# Altium schematic sheet hv_psu_v100_FLYBACK.SchDoc
size A4; SheetNumber: 4; SheetTotal: 7
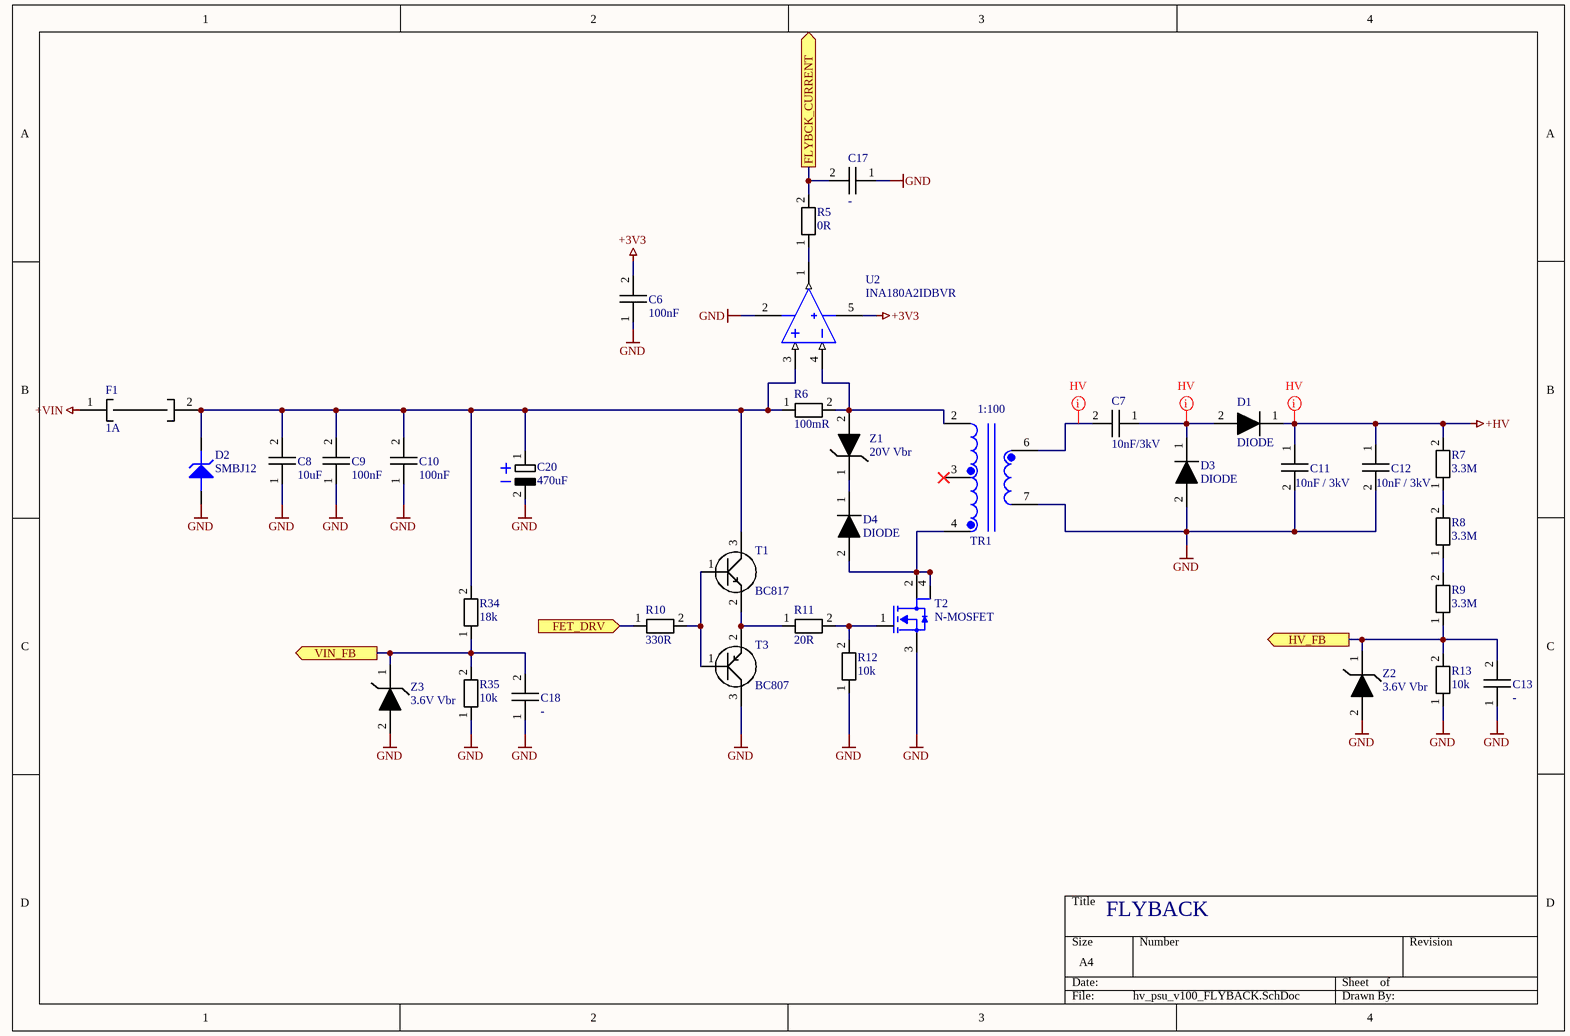
[diagram p0: hv_psu_v100_FLYBACK.SchDoc]

## Parts
C6  100nF  [1206_C]
C7  10nF/3kV  [2220_C]
C8  10uF  [1206_C]
C9  100nF  [1206_C]
C10  100nF  [1206_C]
C11  10nF / 3kV  [2220_C]
C12  10nF / 3kV  [2220_C]
C13  -  [1206_C]
C17  -  [1206_C]
C18  -  [1206_C]
C20  470uF  [CAPAE9383X110M]
D1  DIODE  [DIODE_400MIL]
D2  SMBJ12  [DO-214AA (SMB)]
D3  DIODE  [DIODE_400MIL]
D4  DIODE  [DIODE_400MIL]
F1  1A  [FUSE_1812L]
R5  0R  [1206]
R6  100mR  [1206]
R7  3.3M  [1206]
R8  3.3M  [1206]
R9  3.3M  [1206]
R10  330R  [1206]
R11  20R  [1206]
R12  10k  [1206]
R13  10k  [1206]
R34  18k  [1206]
R35  10k  [1206]
T1  BC817  [SOT23]
T2  N-MOSFET  [SOT233-1]
T3  BC807  [SOT23]
TR1  DARFON_CCFL_TRANSFORMER  [DARFON_CCFL_TRANSFORMER]  (value not drawn)
U2  INA180A2IDBVR  [SOT23-5]
Z1  20V Vbr  [SMD_DIODE_SOD80]
Z2  3.6V Vbr  [SMD_DIODE_SOD80]
Z3  3.6V Vbr  [SMD_DIODE_SOD80]

## Ports
FET_DRV (in), FLYBCK_CURRENT (out), HV_FB (out), VIN_FB (out)

## Nets
+3V3: C6.2 U2.5(V+)
+HV: C11.1 C12.1 D1.1 R7.2
+VIN: F1.1
GND: C6.1 C8.1 C9.1 C10.1 C11.2 C12.2 C13.1 C17.1 C18.1 C20.2 D2.A D3.2 R12.1 R13.1 R35.1 T2.3(S) T3.3 TR1.7 U2.2(V-) Z2.2 Z3.2
FET_DRV: R10.1 ; port FET_DRV
FLYBCK_CURRENT: C17.2 R5.2 ; port FLYBCK_CURRENT
HV_FB: C13.2 R9.1 R13.2 Z2.1 ; port HV_FB
VIN_FB: C18.2 R34.1 R35.2 Z3.1 ; port VIN_FB
NetC7_1: C7.1 D1.2 D3.1
NetC7_2: C7.2 TR1.6
NetC8_2: C8.2 C9.2 C10.2 C20.1 D2.K F1.2 R6.1 R34.2 T1.3 U2.3(IN+)
NetD4_1: D4.1 Z1.1
NetD4_2: D4.2 T2.2(D) T2.4(D) TR1.4
NetR5_1: R5.1 U2.1(OUT)
NetR6_2: R6.2 TR1.2 U2.4(IN-) Z1.2
NetR7_1: R7.1 R8.2
NetR8_1: R8.1 R9.2
NetR10_2: R10.2 T1.1 T3.1
NetR11_1: R11.1 T1.2 T3.2
NetR11_2: R11.2 R12.2 T2.1(G)

Not connected (* = marked no-connect by the designer): TR1 3(2)*

## Layout directives
net class HV: +HV, NetC7_1, NetC7_2

## Notes on the sheet
- FLYBACK
- (in symbol DARFON_CCFL_TRANSFORMER) 1:100

## Library data of the parts
C6 C8-C10 C13 C17 C18 = CAPACITOR
C7 C11 C12 = CAPACITOR: Parameter 1: 2220HC103KAT1A
C20 = CAPACITOR_ELCO
D2 = DIODE_TVS
F1 = FUSE
R5-R11 R34 = RESISTOR: Parameter 1: 10k
R12 R13 R35 = RESISTOR: Parameter 1: 10k
T1 = TRANSISTOR_NPN
T2 = IRLL110: Power N-MOSFET 100V@1.5A 500mR 1.25W SOT223
T3 = TRANSISTOR_PNP
U2 = INA180A2IDBVR: Current Sense Amplifiers MULTI CHANNEL CURRENT SENSE L/H SIDE; Manufacturer_Name: Texas Instruments; Geometry.Height: 1.45mm; Mouser Part Number: 595-INA180A2IDBVR; Mouser Price/Stock: https://www.mouser.co.uk/ProductDetail/Texas-Instruments/INA180A2IDBVR?qs=5aG0NVq1C4wYcJfa99BoHg%3D%3D; Manufacturer_Part_Number: INA180A2IDBVR; Datasheet Link: http://www.ti.com/lit/ds/symlink/ina180.pdf
Z1-Z3 = DIODE_ZENER